# Altium schematic sheet Single_V1.SchDoc
size A4
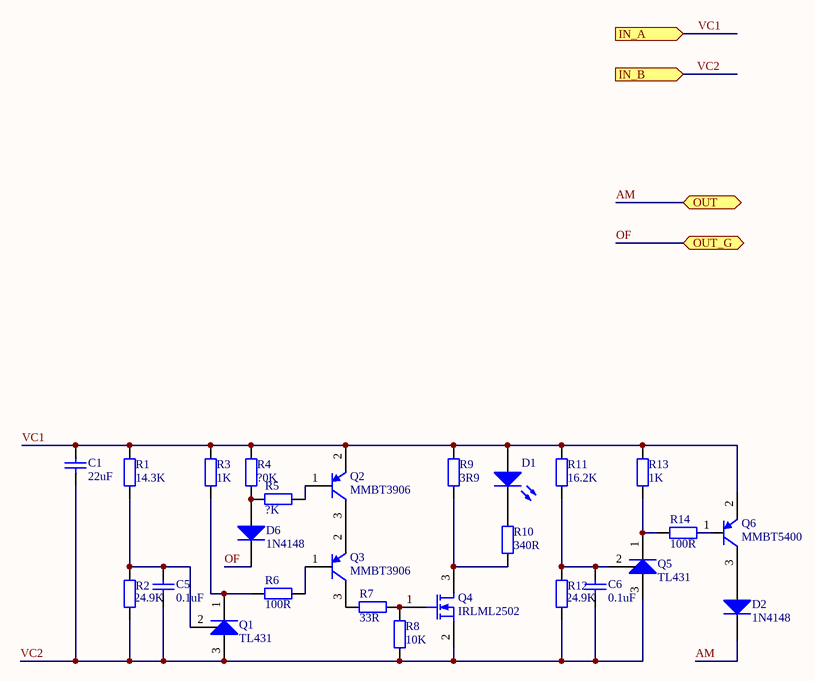
[diagram p0: Single_V1.SchDoc]

## Parts
C1  value 22uF  [C-0603]  (hidden comment: Cap-S)
C5  value 0.1uF  [C-0603]  (hidden comment: Cap-S)
C6  value 0.1uF  [C-0603]  (hidden comment: Cap-S)
D1  LED0  [LED-0805]  (value not drawn)
D2  1N4148  [LED-0805]
D6  1N4148  [LED-0805]
Q1  TL431  [SOT23-3]
Q2  MMBT3906  [SOT23-3]
Q3  MMBT3906  [SOT23-3]
Q4  IRLML2502  [SOT23-3]
Q5  TL431  [SOT23-3]
Q6  MMBT5400  [SOT23-3]
R1  value 14.3K  [0603-1]  (hidden comment: Res1)
R2  value 24.9K  [0603-1]  (hidden comment: Res1)
R3  value 1K  [0603-1]  (hidden comment: Res1)
R4  value ?0K  [0603-1]  (hidden comment: Res1)
R5  value ?K  [0603-1]  (hidden comment: Res1)
R6  value 100R  [0603-1]  (hidden comment: Res1)
R7  value 33R  [0603-1]  (hidden comment: Res1)
R8  value 10K  [0603-1]  (hidden comment: Res1)
R9  value 3R9  [AXIAL-1.0]  (hidden comment: Res1)
R10  value 340R  [0603-1]  (hidden comment: Res1)
R11  value 16.2K  [0603-1]  (hidden comment: Res1)
R12  value 24.9K  [0603-1]  (hidden comment: Res1)
R13  value 1K  [0603-1]  (hidden comment: Res1)
R14  value 100R  [0603-1]  (hidden comment: Res1)

## Ports
IN_A (in), IN_B (in), OUT (bidir), OUT_G (bidir)

## Nets
AM: D2.2(K) ; port OUT
OF: D6.2(K) ; port OUT_G
VC1: C1.2 D1.1(A) Q2.2(E) Q6.2(E) R1.2 R3.2 R4.1 R9.2 R11.2 R13.2 ; port IN_A
VC2: C1.1 C5.1 C6.1 Q1.3(A) Q4.2(S) Q5.3(A) R2.1 R8.1 R12.1 ; port IN_B
NetC5_2: C5.2 Q1.2(R) R1.1 R2.2
NetC6_2: C6.2 Q5.2(R) R11.1 R12.2
NetD1_2: D1.2(K) R10.2
NetD2_1: D2.1(A) Q6.3(C)
NetD6_1: D6.1(A) R4.2 R5.2
NetQ1_1: Q1.1(K) R3.1 R6.2
NetQ2_1: Q2.1(B) R5.1
NetQ2_3: Q2.3(C) Q3.2(E)
NetQ3_1: Q3.1(B) R6.1
NetQ3_3: Q3.3(C) R7.1
NetQ4_1: Q4.1(G) R7.2 R8.2
NetQ4_3: Q4.3(D) R9.1 R10.1
NetQ5_1: Q5.1(K) R13.1 R14.2
NetQ6_1: Q6.1(B) R14.1

## Library data of the parts
C1 C5 C6 = Cap-S: 贴片瓷片电容; Published: 8-Jun-2000; LatestRevisionDate: 17-Jul-2002; LatestRevisionNote: Re-released for DXP Platform.; PackageReference: RAD-0.3; Publisher: Altium Limited
D1 = LED0: 发光二极管; Published: 8-Jun-2000; LatestRevisionDate: 08-Jul-2005; LatestRevisionNote: Mech Layer 1 removed.; PackageReference: LED-0; Publisher: Altium Limited
D2 D6 = Diode-R: 整流二极管; Published: 8-Jun-2000; LatestRevisionDate: 17-Jul-2002; LatestRevisionNote: Re-released for DXP Platform.; PackageDocument: Sep-1996; PackageReference: SMC; Publisher: Altium Limited
Q1 Q5 = TL431: 可控精密稳压源
Q2 Q3 Q6 = PNP1: 贴片三极管; Published: 8-Jun-2000; LatestRevisionDate: 15-Jan-2003; LatestRevisionNote: PCB Footprint 'BCY-W3/D4.7' replaced; DatasheetDocument: 1997; PackageDocument: Sep-1998; PackageReference: TO-92A; Publisher: Altium Limited; Code_JEDEC: TO-92A; ComponentLink1Description: Manufacturer Link; ComponentLink1URL: http://www.fairchildsemi.com/; ComponentLink2Description: Datasheet; ComponentLink2URL: http://www.fairchildsemi.com/ds/2N%2F2N3906.pdf
Q4 = MOSFET-N1: MOSFET; Published: 8-Jun-2000; LatestRevisionDate: 17-Jul-2002; LatestRevisionNote: Re-released for DXP Platform.; PackageVersion: 1995/1996; PackageReference: E3; Publisher: Altium Limited
R1-R14 = Res1: 贴片电阻; Published: 8-Jun-2000; LatestRevisionDate: 17-Jul-2002; LatestRevisionNote: Re-released for DXP Platform.; PackageReference: AXIAL-0.4; Publisher: Altium Limited